# EasyEDA Pro project 2025NUEDC_A_Project.eprj, schematic Schematic1_1
Board Name: Board1; Create Date: 2024-07-09; Page Name: P1; Project Name: 双向DC-DC模块; Schematic Name: Schematic1; Update Date: 2025-07-15; Company: 嘉立创EDA; Page Size: A4; Version: V1.0
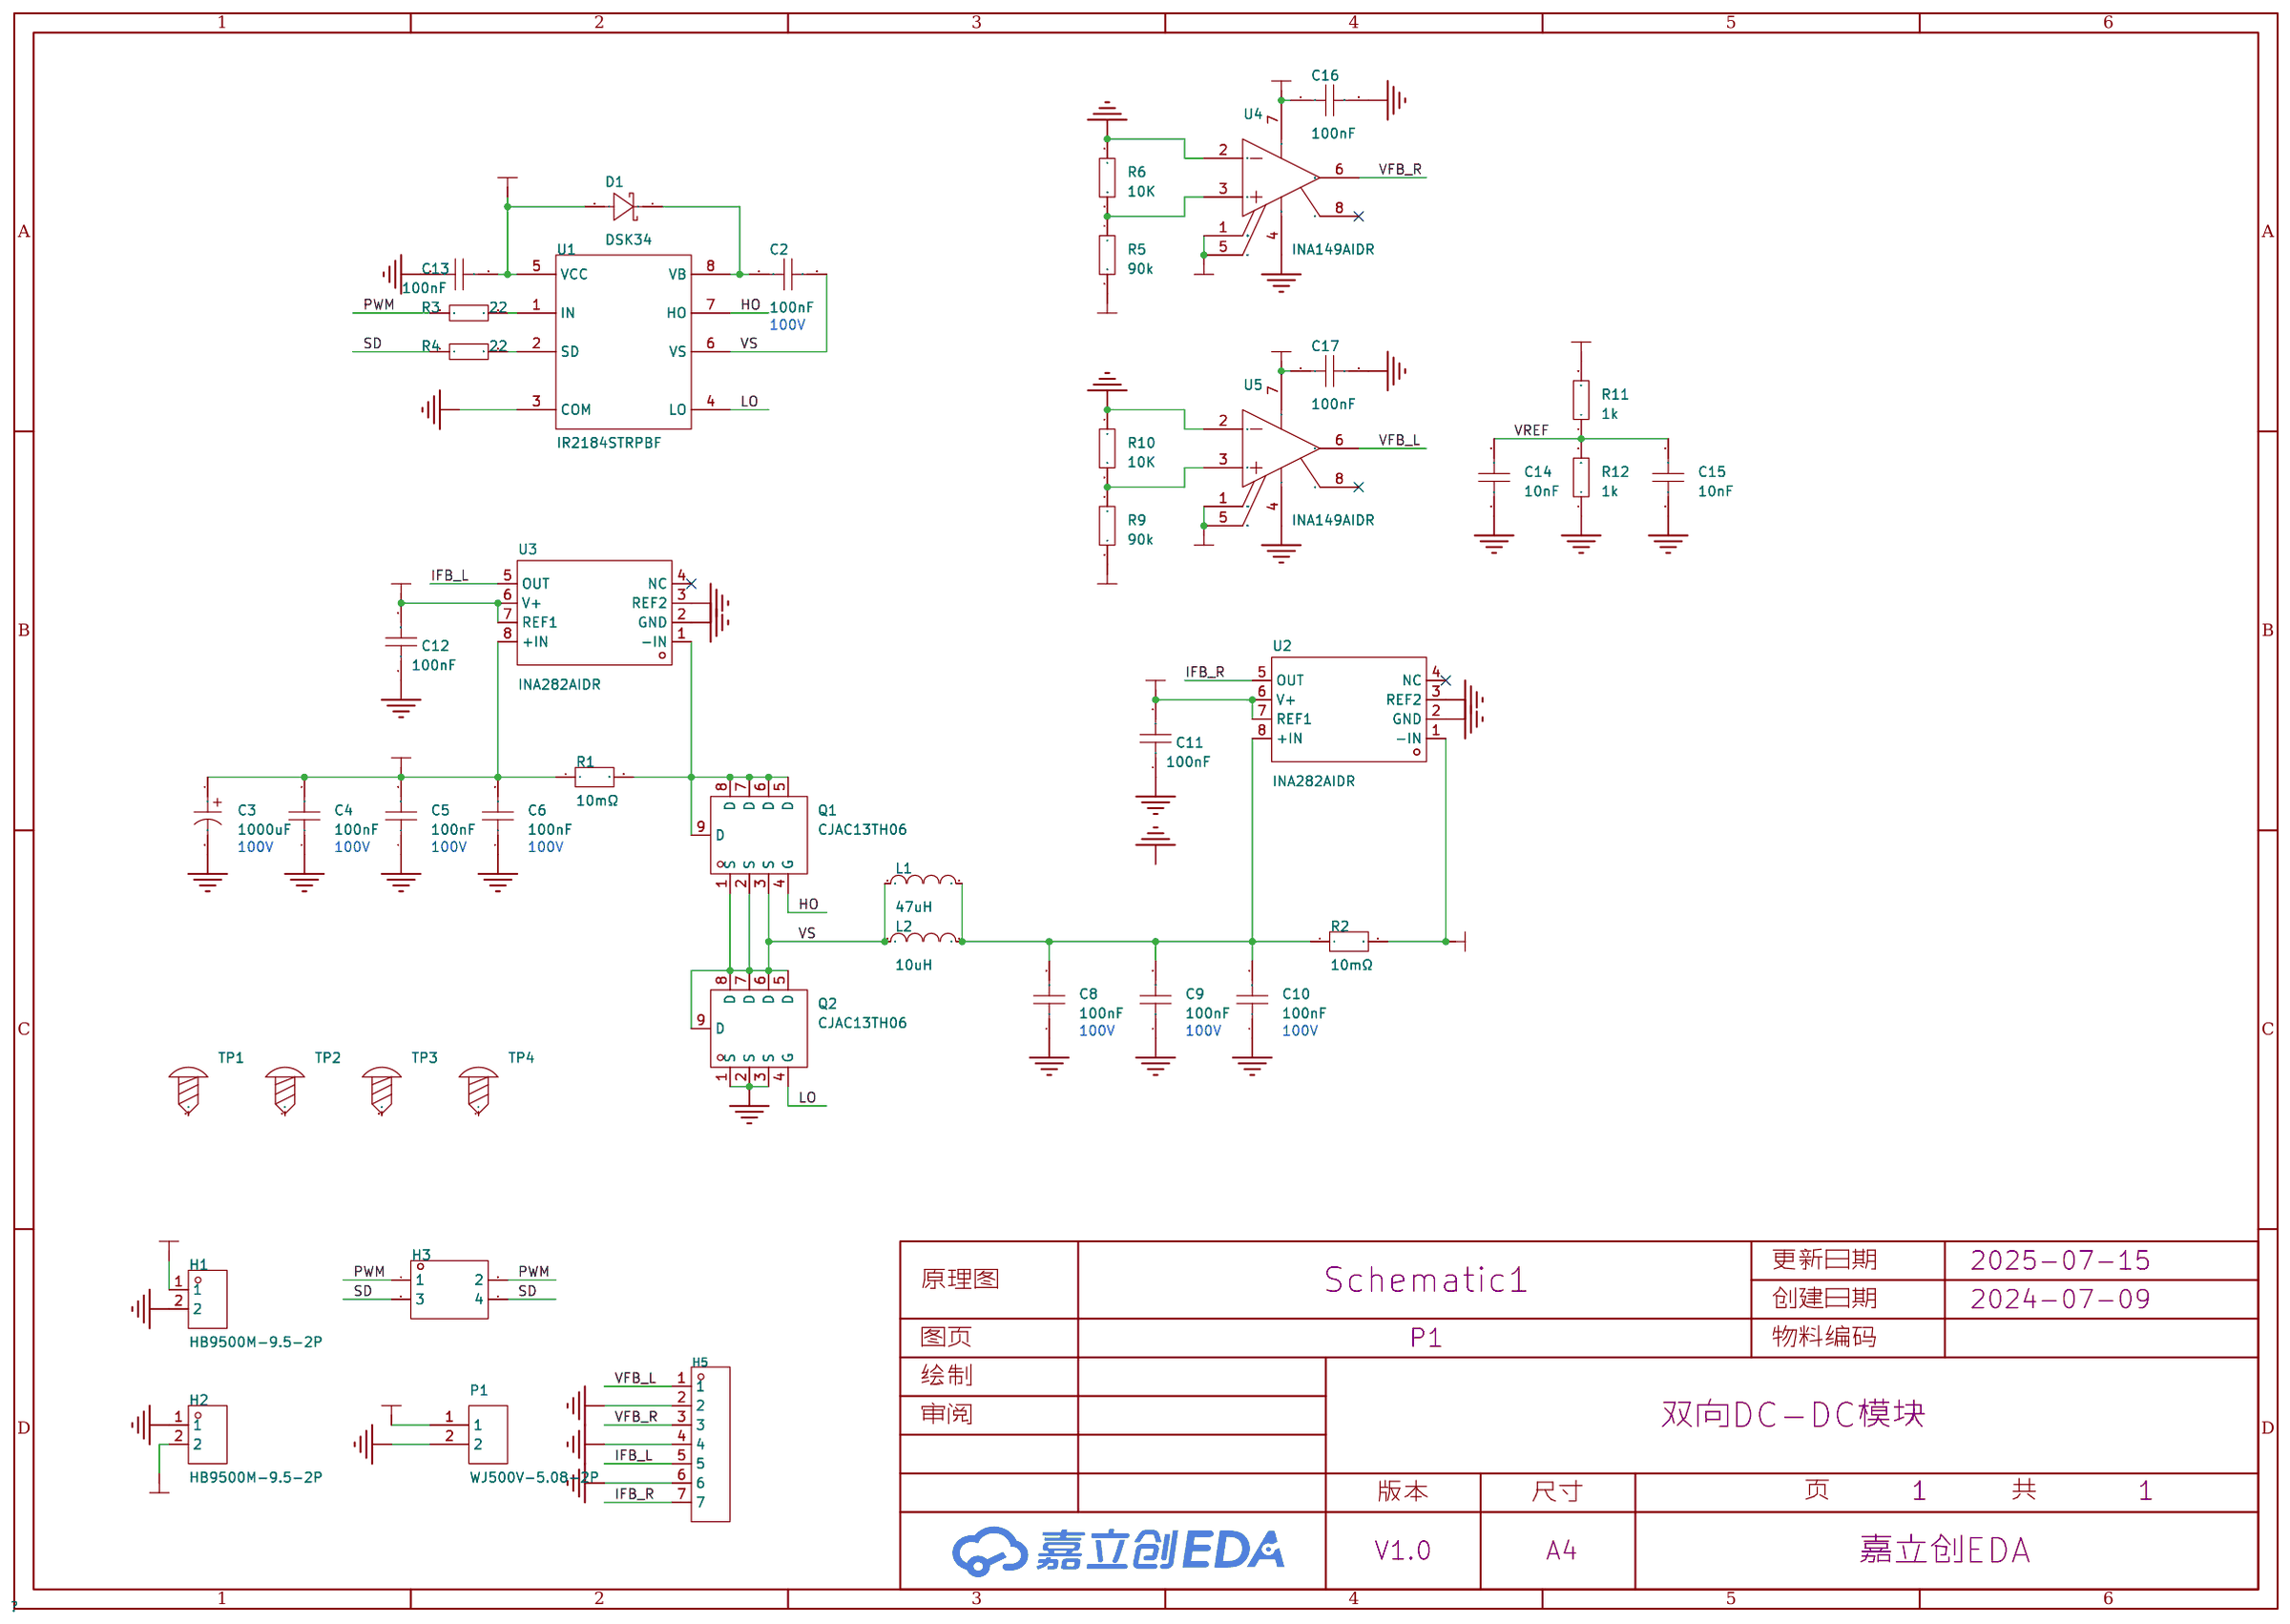
[diagram p0: schematic sheet]

## Parts
C2  100nF  [C0805]
C3  1000uF  [CAP-TH_BD10.0-P5.00-D0.6-FD]
C4  100nF  [C0805]
C5  100nF  [C0805]
C6  100nF  [C0805]
C8  100nF  [C0805]
C9  100nF  [C0805]
C10  100nF  [C0805]
C11  100nF  [C0603]
C12  100nF  [C0603]
C13  100nF  [C0603]
C14  10nF  [C0603]
C15  10nF  [C0603]
C16  100nF  [C0603]
C17  100nF  [C0603]
D1  DSK34  [SOD-123FL_L2.7-W1.8-LS3.8-RD]
H1  HB9500M-9.5-2P  [CONN-TH_HB9500M-9.5-2P]
H2  HB9500M-9.5-2P  [CONN-TH_HB9500M-9.5-2P]
H3  -  [HDR-TH_4P-P2.54-V-F-R2-C2-S2.54]
H5  -  [HDR-TH_7P-P2.54-V-M]
L1  47uH  [IND-TH_L20.0-W9.0-P8.00-D1.0]
L2  10uH  [IND-SMD_L13.5-W12.6_FAUL136X]
P1  WJ500V-5.08-2P  [CONN-TH_2P-P5.00_WJ500V-5.08-2P]
Q1  CJAC13TH06  [PDFN-8_L5.8-W4.9-P1.27-LS6.1-BL]
Q2  CJAC13TH06  [PDFN-8_L5.8-W4.9-P1.27-LS6.1-BL]
R1  10mΩ  [R2512]
R2  10mΩ  [R2512]
R3  22  [R0603]
R4  22  [R0603]
R5  90k  [R0603]
R6  10K  [R0603]
R9  90k  [R0603]
R10  10K  [R0603]
R11  1k  [R0603]
R12  1k  [R0603]
TP1  -  [M3螺丝]
TP2  -  [M3螺丝]
TP3  -  [M3螺丝]
TP4  -  [M3螺丝]
U1  IR2184STRPBF  [SOIC-8_L5.0-W4.0-P1.27-LS6.0-BL]
U2  INA282AIDR  [SOIC-8_L4.9-W3.9-P1.27-LS6.0-BL]
U3  INA282AIDR  [SOIC-8_L4.9-W3.9-P1.27-LS6.0-BL]
U4  INA149AIDR  [SOIC-8_L4.9-W3.9-P1.27-LS6.0-BL]
U5  INA149AIDR  [SOIC-8_L4.9-W3.9-P1.27-LS6.0-BL]

## Library data of the parts
C2 C4-C6 C8-C10 = CAP_0805: Supplier Footprint: 0805
C3 = CD2881081EM1017VFL: 容值:1000uF;额定电压:25V;; LCSC Part Name: 1000uF 25V; Supplier Part: C7493865; Manufacturer: HRK(鸿瑞凯电子); Supplier Footprint: 插件,D10xL17mm; JLCPCB Part Class: 扩展库; Supplier: LCSC; Voltage Rating: 25V
C11-C17 = CAP_0603: Supplier Footprint: 0603
D1 = DSK34_C7502709: 二极管配置:独立式;正向压降(Vf):550mV@3A;直流反向耐压(Vr):40V;整流电流:3A;; LCSC Part Name: 电压:40V 电流:3A; Supplier Part: C7502709; Manufacturer: 宏迦橙; Supplier Footprint: SOD-123FL; JLCPCB Part Class: Extended Part; Datasheet: https://atta.szlcsc.com/upload/public/pdf/source/20240814/5E8D2EAF2EE69BEF369BE6AC64F67CC4.pdf; Supplier: LCSC; Diode Configuration: 独立式; Forward Voltage (Vf@If): 550mV@3A; Reverse Voltage (Vr): 40V; Rectified Current: 3A; Reverse Leakage Current (Ir): 500uA
H1 H2 = HB9500M-9.5-2P: 隔板类型:带盖板;间距:9.5mm;结构:1x2P;安装方式:直针;引脚位置:边脚;排数:1;额定电流:32A;额定电压:750V;线规 - AWG:12~22;线规 - 平方毫米:4;工作温度范围:-40℃~+105℃;颜色:黑色;每排PIN数:2;; LCSC Part Name: 9.5mm 1x2P 每排P数:2 排数:1 直针 边脚; Supplier Part: C601239; Manufacturer: KANGNEX(康奈克斯电气); Supplier Footprint: 插件,P=9.5mm; JLCPCB Part Class: 扩展库; Datasheet: https://atta.szlcsc.com/upload/public/pdf/source/20191225/C255007_AEFFD334AF0EDC7F7866E87DB28F3A93.pdf; Supplier: LCSC; Barrier Type: 带盖板; Pitch: 9.5mm; Structure: 1x2P; Mounting Style: 直针; Pin Location: 边脚; Number of Pins: 2P; Number of Rows: 1; Current Rating (Max): 32A; Voltage Rating (Max): 750V; Wire Gauge - AWG: 12~22; Wire Gauge - mm2: 4; Operating Temperature Range: -40℃~+105℃; Color: 黑色; Number of PINs Per Row: 2
H3 = HDR-F_2.54_2x2: Supplier Part: C92273; Supplier Footprint: 插件
H5 = HDR-M_2.54_1x7P: Supplier Part: C492406; Supplier Footprint: 插件
L1 = XR065125T470MV1L: 电感值:47uH;精度:±10%;额定电流:7.8A;类型:磁环电感;; Supplier Part: C18213929; Manufacturer: XR(祥如); Supplier Footprint: 插件,D=20mm; JLCPCB Part Class: 扩展库; Datasheet: https://atta.szlcsc.com/upload/public/pdf/source/20231010/842403E5F9633A96AB1B00766EE4450D.pdf; Supplier: LCSC; Tolerance: ±10%; Rated Current: 7.8A; Type: 磁环电感; Wire Diameter: 1mm
L2 = FXL1360-100-M: 电感值:10uH;精度:±20%;额定电流:10A;饱和电流(Isat):12.5A;类型:一体成型电感;; LCSC Part Name: 10uH ±20% 12.5A; Supplier Part: C526024; Manufacturer: cjiang(长江微电); Supplier Footprint: SMD,12.6x13.5mm; JLCPCB Part Class: 扩展库; Datasheet: https://atta.szlcsc.com/upload/public/pdf/source/20240426/3189EA8206330E2108542F9E34E540E7.pdf; Supplier: LCSC; Tolerance: ±20%; Rated Current: 10A; Saturation Current (Isat): 12.5A; DC Resistance (DCR): 20.7mΩ; Type: 一体成型电感
P1 = WJ500V-5.08-2P: 结构:1x2P;间距:5.08mm;颜色:绿色;安装方式:直插;额定电流:18A;额定电压:250V;排数:1;线规 - AWG:14~30;线规 - 平方毫米:2.5;每排PIN数:2;触头材质:-;触头镀层:-;工作温度范围:-40℃~+105℃;焊接温度(最大值):-;; LCSC Part Name: 1x2P 5.08mm 直插 排数:1 每排P数:2; Supplier Part: C8465; Manufacturer: KANGNEX(康奈克斯电气); Supplier Footprint: 插件,P=5.08mm; JLCPCB Part Class: 扩展库; Datasheet: https://atta.szlcsc.com/upload/public/pdf/source/20191225/C8465_02D34CE5B5B4A53DF5891601D97FA9F4.pdf; Supplier: LCSC; Structure: 1x2P; Pitch: 5.08mm; Color: 绿色; Mounting Style: 直插; Current Rating (Max): 18A; Voltage Rating (Max): 250V; Number of Pins: 2P; Number of Rows: 1; Wire Gauge - AWG: 14~30; Wire Gauge - mm2: 2.5; Number of PINs Per Row: 2; Operating Temperature Range: -40℃~+105℃; Screw Specification: M2.5
Q1 Q2 = CJAC13TH06: 类型:1个N沟道;漏源电压(Vdss):60V;连续漏极电流(Id):130A;导通电阻(RDS(on)@Vgs,Id):2.2mΩ@10V;功率(Pd):140W;阈值电压(Vgs(th)@Id):1V@250uA;; LCSC Part Name: 1个N沟道 耐压:60V 电流:130A; Supplier Part: C504082; Manufacturer: CJ(江苏长电/长晶); Supplier Footprint: PQFNWB-8L(5x6); JLCPCB Part Class: 扩展库; Datasheet: https://atta.szlcsc.com/upload/public/pdf/source/20211104/6D1C972394E17010EFF79E24DEBC0797.pdf; Supplier: LCSC; Type: 1个N沟道; Drain Source Voltage (Vdss): 60V; Continuous Drain Current (Id): 130A; Drain Source On Resistance (RDS(on)@Vgs,Id): 2.2mΩ@10V; Power Dissipation (Pd): 140W; Gate Threshold Voltage (Vgs(th)@Id): 1V@250uA; Total Gate Charge (Qg@Vgs): 63.7nC@10V; Input Capacitance (Ciss@Vds): 5.298nF; Reverse Transfer Capacitance (Crss@Vds): 74.8pF; Operating Temperature: -55℃~+150℃
R1 R2 = RE2512F3R010: 电阻类型:采样电阻;阻值:10mΩ;精度:±1%;功率:3W;温度系数:±50ppm/℃;; LCSC Part Name: 10mΩ 3W 2512 ±1%; Supplier Part: C46961753; Manufacturer: 捷而瑞; Supplier Footprint: 2512; JLCPCB Part Class: 扩展库; Datasheet: https://atta.szlcsc.com/upload/public/pdf/source/20250325/401775B85EF7B3A580BC34DFED100CB2.pdf; Supplier: LCSC; Type: 采样电阻; Tolerance: ±1%; Power(Watts): 3W; Temperature Coefficient: ±50ppm/℃
R3-R6 R9-R12 = Res_0603: Supplier Footprint: 0603
TP1-TP4 = M3螺丝: Supplier Footprint: 插件
U1 = IR2184STRPBF: 驱动配置:半桥;负载类型:IGBT；MOSFET;驱动通道数:2;灌电流(IOL):1.8A;拉电流(IOH):1.4A;工作电压:10V~20V;上升时间(tr):40ns;下降时间(tf):20ns;; Supplier Part: C2995; Manufacturer: Infineon(英飞凌); Supplier Footprint: SOIC-8; JLCPCB Part Class: 扩展库; Datasheet: https://atta.szlcsc.com/upload/public/pdf/source/20180428/C212202_166266BE420162375EE24979A7C0A97C.pdf; Supplier: LCSC; Driven Configuration: 半桥; Load Type: IGBT；MOSFET; Number of Drivers: 2; Current - Output Low(IOL): 1.8A; Current - Output High(IOH): 1.4A; Voltage - Supply: 10V~20V; Rise Time: 40ns; Fall Time: 20ns; Operating Temperature: -40℃~+150℃@(Tj)
U2 U3 = INA282AIDR: INA282 -14V 至 +80V、双向、高精度、低侧或高侧、高速、电压输出电流分流监控器; Supplier Part: C53319; Manufacturer: TI(德州仪器); Supplier Footprint: SOIC-8; JLCPCB Part Class: 扩展库; Datasheet: https://www.ti.com/cn/lit/gpn/ina282; Supplier: LCSC; Supply Voltage: -14V~80V; Operating Temperature: -40℃~+125℃
U4 U5 = INA149AIDR: 放大器数:单路;共模抑制比(CMRR):90dB;输入偏置电流(Ib):-;输入失调电压(Vos):350uV;增益带宽积(GBP):-;压摆率(SR):5V/us;带宽(-3db):500kHz;轨到轨:轨到轨输出;; LCSC Part Name: 高共模电压差分放大器; Supplier Part: C183089; Manufacturer: TI(德州仪器); Supplier Footprint: SOIC-8; JLCPCB Part Class: 扩展库; Datasheet: https://www.ti.com/cn/lit/gpn/ina149; Supplier: LCSC; Number of Channels: 单路; Common Mode Rejection Ratio(CMRR): 90dB; Vos - Input Offset Voltage: 350uV; Slew Rate: 5V/us; Voltage - Supply: 2V~18V；-18V~-2V; -3dB Bandwidth: 500kHz; Rail to Rail: 轨到轨输出; Input Offset Voltage Drift(Vos TC): 3uV/℃; Operating Temperature: -40℃~+125℃

## Nets
GND: C3.2 C4.1 C5.1 C6.1 C8.1 C9.1 C10.1 C11.1 C12.1 C13.1 C14.1 C15.1 C16.2 C17.2 H1.2 H2.1 H5.2 H5.4 H5.6 P1.2 Q2.1(S) Q2.2(S) Q2.3(S) R6.1 R10.1 R12.1 U1.3(COM) U2.2(GND) U2.3(REF2) U3.2(GND) U3.3(REF2) U4.2(IN-) U4.4(V-) U5.2(IN-) U5.4(V-)
AUXP: C11.2 C12.2 C13.2 C16.1 C17.1 D1.2(A) P1.1 R11.2 U1.5(VCC) U2.6(V+) U2.7(REF1) U3.6(V+) U3.7(REF1) U4.7(V+) U5.7(V+)
HO: Q1.4(G) U1.7(HO)
IFB_L: H5.5 U3.5(OUT)
IFB_R: H5.7 U2.5(OUT)
LO: Q2.4(G) U1.4(LO)
PWM: H3.1 H3.2 R3.1
SD: H3.3 H3.4 R4.1
VFB_L: H5.1 U5.6(VOUT)
VFB_R: H5.3 U4.6(VOUT)
VLEFT: C3.1 C4.2 C5.2 C6.2 H1.1 R1.1 R9.2 U3.8(+IN)
VREF: C14.2 C15.2 R11.1 R12.2 U4.1(REFB) U4.5(REFA) U5.1(REFB) U5.5(REFA)
VRIGHT: H2.2 R2.2 R5.2 U2.1(-IN)
VS: C2.2 L1.1 L2.1 Q1.1(S) Q1.2(S) Q1.3(S) Q2.5(D) Q2.6(D) Q2.7(D) Q2.8(D) Q2.9(D) U1.6(VS)
$1N3848: C2.1 D1.1(K) U1.8(VB)
$1N7080: Q1.5(D) Q1.6(D) Q1.7(D) Q1.8(D) Q1.9(D) R1.2 U3.1(-IN)
$1N8011: R3.2 U1.1(IN)
$1N8015: R4.2 U1.2(SD)
$1N11764: R5.1 R6.2 U4.3(IN+)
$1N12012: R9.1 R10.2 U5.3(IN+)
Net-(C8-2): C8.2 C9.2 C10.2 L1.2 L2.2 R2.1 U2.8(+IN)

Not connected (* = marked no-connect by the designer): TP1 1; TP2 1; TP3 1; TP4 1; U2 4(NC)*; U3 4(NC)*; U4 8(NC)*; U5 8(NC)*

## Notes on the sheet
- 100V
- 100V
- 100V
- 100V
- 100V
- 100V
- 100V
- 100V
